# EasyEDA Pro project EasyEDA_ELRS-Transmitter.epro

# Schematic Schematic2
Board Name: PCB2; Create Date: 2026-03-08; Page Name: P1; Project Name: elrsTransmitter; Schematic Name: Schematic2; Update Date: 2026-03-08; Company: EasyEDA.com; Page Size: A4; Version: V1.0
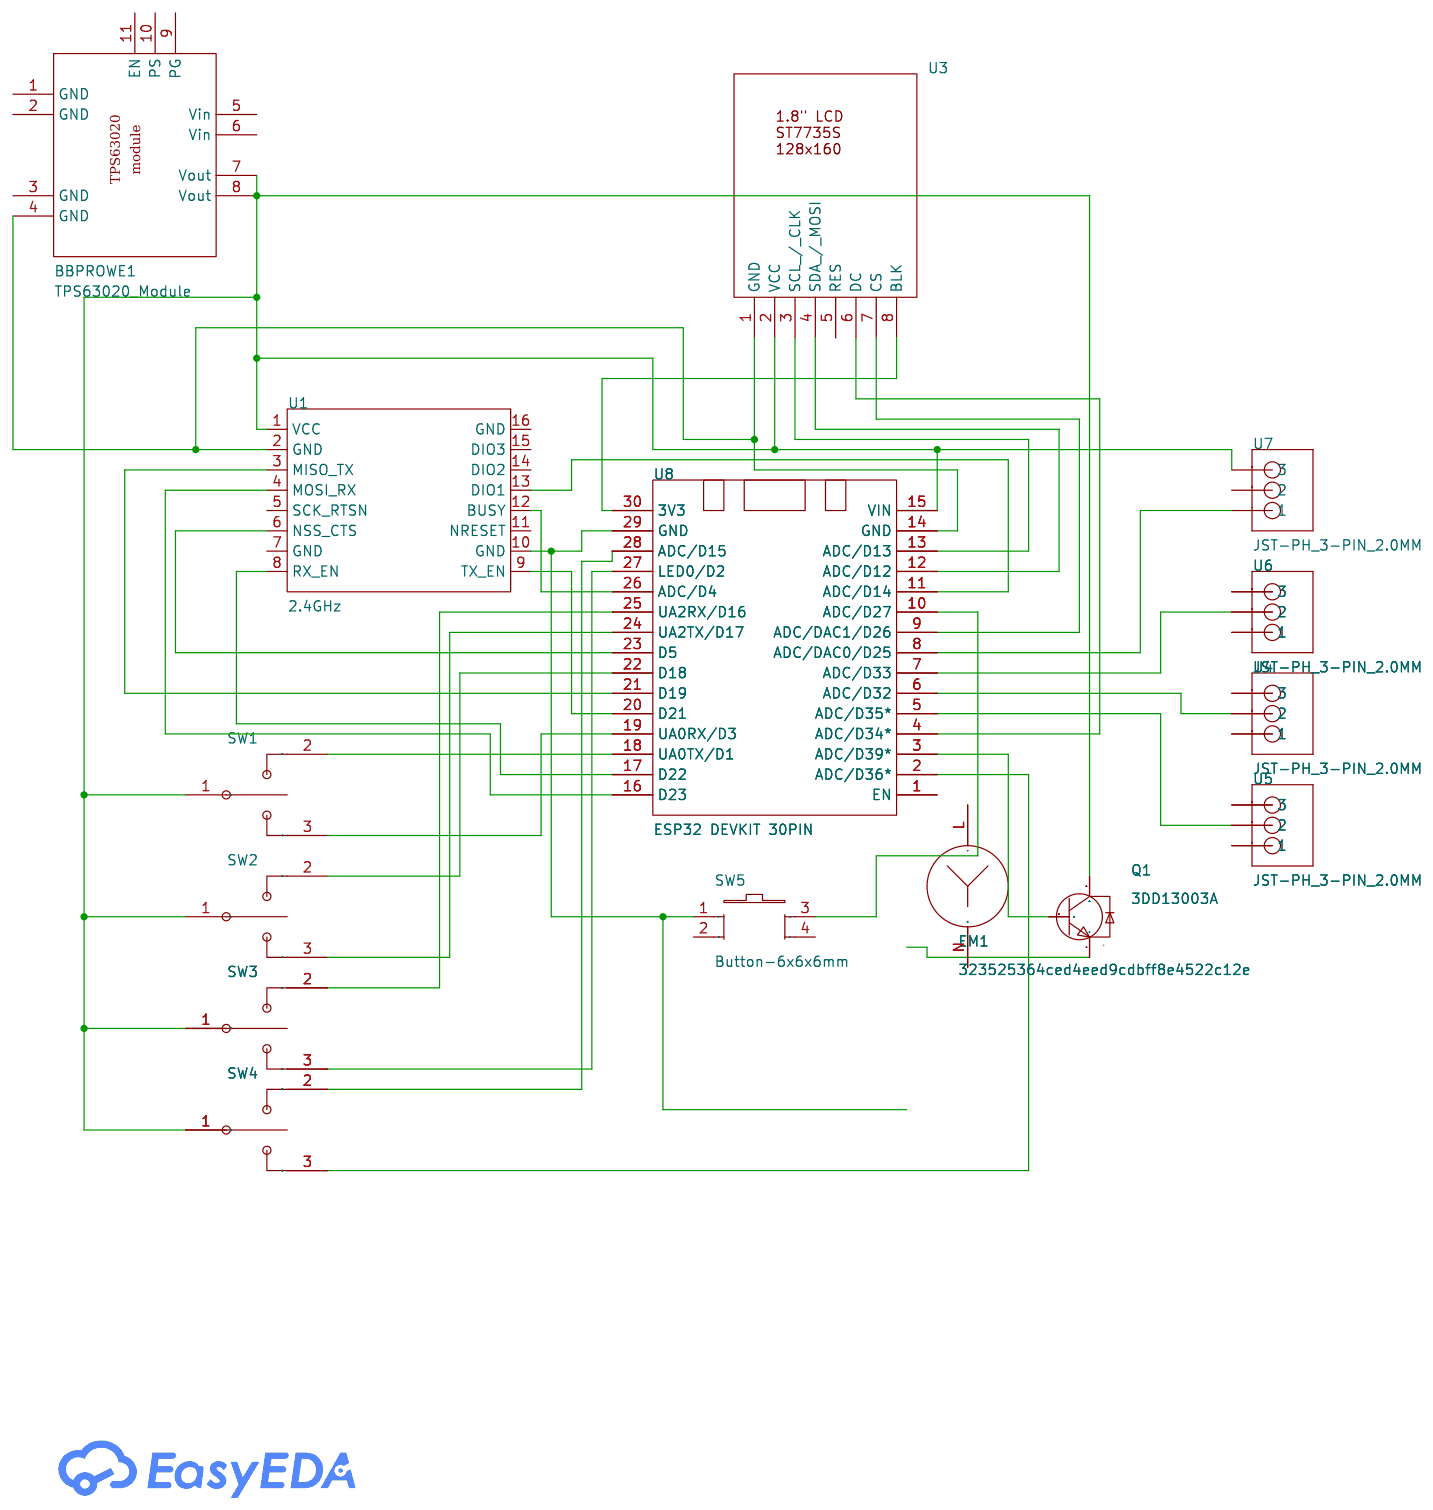
[diagram p0: schematic sheet]

## Parts
BBPROWE1  TPS63020_Module  [TPS63020_MODULE_PCB]
EM1  323525364ced4eed9cdbff8e4522c12e  [CONN-TH_2P-P2.54-V]
Q1  3DD13003A  [TO-92-3_L4.8-W3.7-P1.27-L]
SW1  -  [3_Pin_Toggle_Switch_Footprint]
SW2  -  [3_Pin_Toggle_Switch_Footprint]
SW3  -  [3_Pin_Toggle_Switch_Footprint]
SW4  -  [3_Pin_Toggle_Switch_Footprint]
SW5  Button-6x6x6mm  [SW-TH_4PIN-L6.00-W6.00]
U1  2.4GHz  [WIRELM-SMD_E28-2G4M27SX]
U3  -  [WeAct 1.8 inch TFT ST7735S]
U4  JST-PH_3-PIN_2.0MM  [JST PH 3-PIN 2.0MM TOP ENTRY]
U5  JST-PH_3-PIN_2.0MM  [JST PH 3-PIN 2.0MM TOP ENTRY]
U6  JST-PH_3-PIN_2.0MM  [JST PH 3-PIN 2.0MM TOP ENTRY]
U7  JST-PH_3-PIN_2.0MM  [JST PH 3-PIN 2.0MM TOP ENTRY]
U8  ESP32 DEVKIT 30PIN  [ESP32 DEVKIT 30P]

## Library data of the parts
BBPROWE1 = TPS63020_Module
EM1 = GVI AC Fan: GVI AC Fan for half size server rack; Manufacturer: GVI
Q1 = 3DD13003A: Current - Collector(Ic):1.5A Collector - Emitter Voltage VCEO:450V Pd - Power Dissipation:40W Transition frequency(fT):4MHz Current - Collector Cutoff:100uA Vce Saturation(VCE(sat)):2V@1.5A,0.5A; LCSC Part Name: MOSFET管; Supplier Part: C5148290; Manufacturer: 吉林华微; Supplier Footprint: TO-92-FJ; JLCPCB Part Class: Extended Part; Datasheet: https://item.szlcsc.com/datasheet/3DD13003A/5771105.html; Supplier: LCSC; Current - Collector(Ic): 1.5A; Collector - Emitter Voltage VCEO: 450V; Pd - Power Dissipation: 40W; Transition frequency(fT): 4MHz; Current - Collector Cutoff: 100uA; Vce Saturation(VCE(sat)): 2V@1.5A,0.5A
SW1-SW4 = 3_Position_Toggle_Switch
SW5 = Button-6x6x6mm: Supplier Part: C71836; Supplier: LCSC; Manufacturer: BBJ; Manufacturer Part: Switch,6*6*6Plastic head,260G, 0.25mm,Straight line
U1 = E28-2G4M27SX: Frequency:2.4GHz; LCSC Part Name: 2.4G LORA扩频 SX1280spi模组 测距定位RSSI; Supplier Part: C5333988; Manufacturer: EBYTE(亿佰特); Supplier Footprint: SMD,20x16mm; JLCPCB Part Class: Extended Part; Datasheet: https://item.szlcsc.com/datasheet/E28-2G4M27SX/6097540.html; Supplier: LCSC
U3 = WeAct 1.8inch TFT Display ST7735
U4-U7 = JST-PH_3-PIN_2.0MM
U8 = ESP32 DEVKIT 30PIN

## Nets
$1N1359: BBPROWE1.4(GND) U1.2(GND) U3.1(GND) U8.14(GND)
$1N1452: BBPROWE1.7(Vout) BBPROWE1.8(Vout) Q1.2(C) SW1.1 SW2.1 SW3.1 SW4.1 U1.1(VCC) U3.2(VCC) U7.3 U8.15(VIN)
$1N1514: U1.3(MISO_TX) U8.21(D19)
$1N1520: U1.4(MOSI_RX) U8.16(D23)
$1N1532: U1.6(NSS_CTS) U8.23(D5)
$1N1538: U1.9(TX_EN) U8.20(D21)
$1N1545: U1.8(RX_EN) U8.17(D22)
$1N1554: U1.13(DIO1) U8.11(ADC/D14)
$1N1582: U1.12(BUSY) U8.26(ADC/D4)
$1N1700: SW1.2 U8.18(UA0TX/D1)
$1N1708: SW1.3 U8.19(UA0RX/D3)
$1N1714: SW2.2 U8.22(D18)
$1N1721: SW2.3 U8.24(UA2TX/D17)
$1N1728: SW3.2 U8.25(UA2RX/D16)
$1N1735: SW3.3 U8.27(LED0/D2)
$1N1742: SW4.2 U8.28(ADC/D15)
$1N1753: SW4.3 U8.2(ADC/D36*)
$1N1760: Q1.3(B) U8.3(ADC/D39*)
$1N1766: U3.3(SCL / CLK) U8.13(ADC/D13)
$1N1773: U3.4(SDA / MOSI) U8.12(ADC/D12)
$1N1780: U3.7(CS) U8.9(ADC/DAC1/D26)
$1N1788: U3.6(DC) U8.4(ADC/D34*)
$1N1827: U3.8(BLK) U8.30(3V3)
$1N1835: U7.1 U8.8(ADC/DAC0/D25)
$1N1841: U6.2 U8.7(ADC/D33)
$1N1848: U4.2 U8.6(ADC/D32)
$1N1855: U5.2 U8.5(ADC/D35*)
$1N2129: SW5.3 U8.10(ADC/D27)
Net-(SW5-1): SW5.1 U1.10(GND) U8.29(GND)

Not connected (* = marked no-connect by the designer): BBPROWE1 1(GND) 2(GND) 3(GND) 5(Vin) 6(Vin) 9(PG) 10(PS) 11(EN); EM1 L N; Q1 1(E); SW5 2 4; U1 5(SCK_RTSN) 7(GND) 11(NRESET) 14(DIO2) 15(DIO3) 16(GND); U3 5(RES); U4 1 3; U5 1 3; U6 1 3; U7 2; U8 1(EN)

# Board PCB2
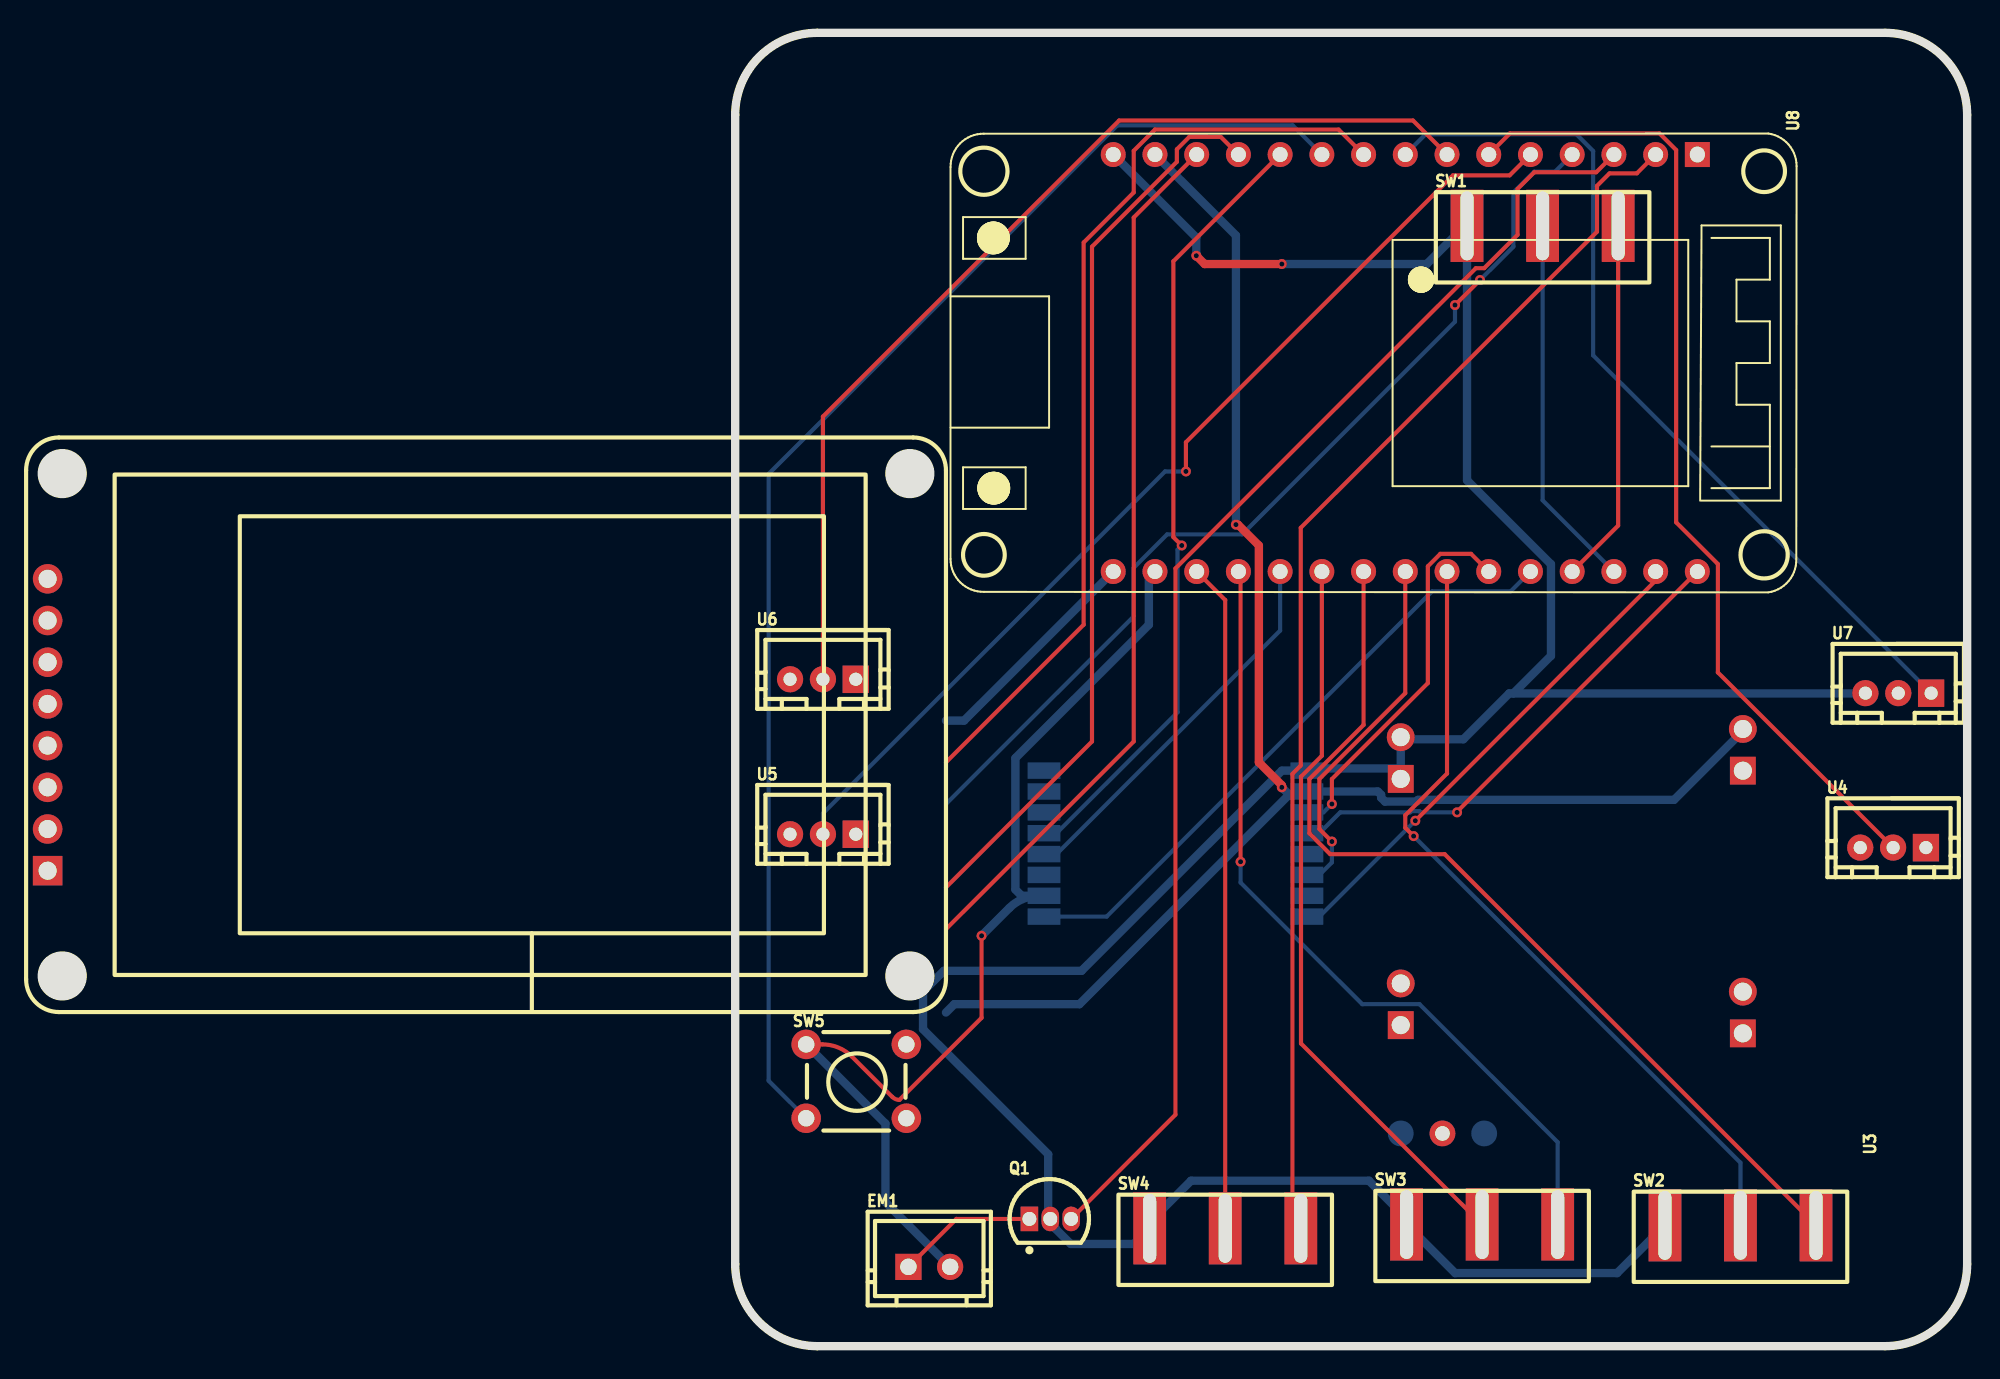
[diagram p1: board, top side]
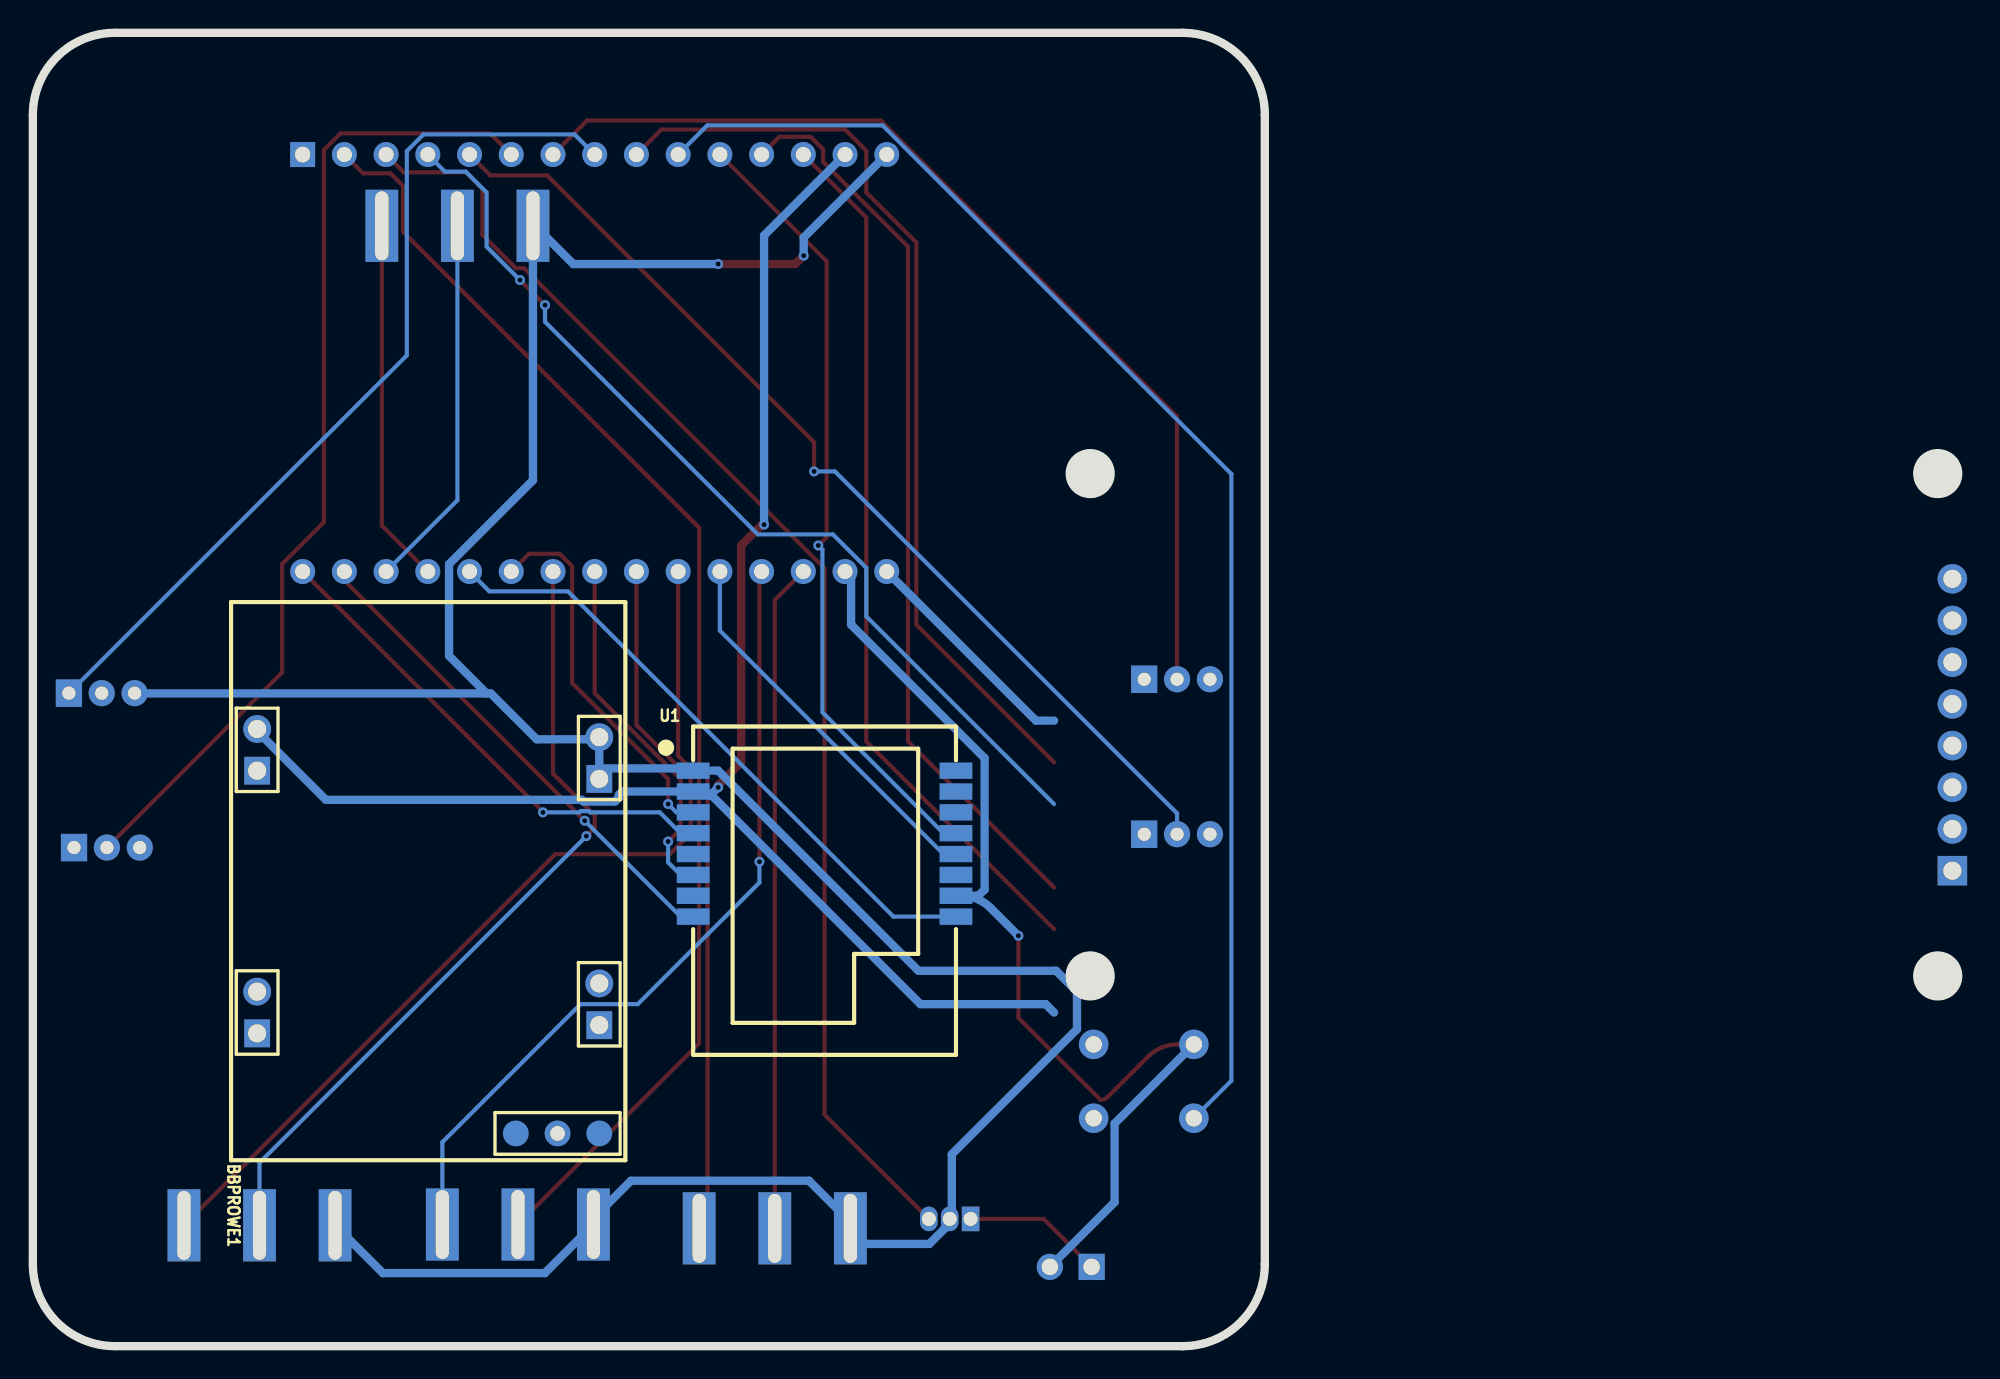
[diagram p2: board, bottom side, seen from below]

Outline 117.46 x 80 mm; copper layers: Top Layer, Bottom Layer. Coordinates in mm from the lower left corner of the outline.
Outline path: 42.46,75 arc(43.93,78.54) 47.46,80 112.46,80 arc(116,78.53) 117.46,75 117.46,5 arc(116,1.46) 112.46,0 47.46,0 arc(43.93,1.46) 42.46,5 42.46,75
Stack: Top Layer 0.035mm / Dielectric1 1.51mm FR4 er 4.5 / Bottom Layer 0.035mm

## Design rules (mm)
template: JLCPCB Capability(Two Layers Board)
spacing copperThickness1oz (default): track to track 0.102, other pairs 0.152 to 0.3
spacing copperThickness2oz: track to track 0.203, other pairs 0.152 to 0.3
track width copperThickness1oz (default): min 0.127, default 0.254, max 2.54
track width copperThickness2oz: min 0.203, default 0.254, max 2.54
differential pair differentialPair (default): width min 0.127, default 0.254, max 2.54; gap min 0.152, default 0.152
via viaSize (default): diameter min 0.5, default 0.61, max 10; hole min 0.3, default 0.305, max 6.3

## Placement (name value [footprint] x y rotation side)
BBPROWE1  TPS63020_Module  [TPS63020_MODULE_PCB]  93.4 28.33 90 bottom
EM1  323525364ced4eed9cdbff8e4522c12e  [CONN-TH_2P-P2.54-V]  54.28 4.83 0 top
Q1  3DD13003A  [TO-92-3_L4.8-W3.7-P1.27-L]  61.65 7.75 0 top
SW1  -  [3_Pin_Toggle_Switch_Footprint]  91.62 66.04 0 top
SW2  -  [3_Pin_Toggle_Switch_Footprint]  103.66 5.16 0 top
SW3  -  [3_Pin_Toggle_Switch_Footprint]  87.93 5.21 0 top
SW4  -  [3_Pin_Toggle_Switch_Footprint]  72.3 4.98 0 top
SW5  Button-6x6x6mm  [SW-TH_4PIN-L6.00-W6.00]  49.83 16.13 0 top
U1  2.4GHz  [WIRELM-SMD_E28-2G4M27SX]  69.27 30.61 180 bottom
U3  -  [WeAct 1.8 inch TFT ST7735S]  55.3 20.32 90 top
U4  JST-PH_3-PIN_2.0MM  [JST PH 3-PIN 2.0MM TOP ENTRY]  108.96 28.57 0 top
U5  JST-PH_3-PIN_2.0MM  [JST PH 3-PIN 2.0MM TOP ENTRY]  43.8 29.39 0 top
U6  JST-PH_3-PIN_2.0MM  [JST PH 3-PIN 2.0MM TOP ENTRY]  43.8 38.82 0 top
U7  JST-PH_3-PIN_2.0MM  [JST PH 3-PIN 2.0MM TOP ENTRY]  109.27 37.98 0 top
U8  ESP32 DEVKIT 30PIN  [ESP32 DEVKIT 30P]  105.08 71.89 270 top

## Footprints (pads in the part's own frame, mm; a bottom-side part is the same pattern mirrored in y, then rotated)
3_Pin_Toggle_Switch_Footprint
  rect 2x4.4 hole 0.8x4.2: 1(-4.6,2.2) 2(0,2.2) 3(4.6,2.2)
CONN-TH_2P-P2.54-V
  rect 1.6x1.6 hole 1: L(-1.27,0)
  round 1.6 hole 1: N(1.27,0)
ESP32 DEVKIT 30P
  rect 1.524x1.524 hole 0.96x0.914: 1(-0.7,-4.04)
  round 1.524 hole 0.914: 2(-0.7,-6.58) 3(-0.7,-9.12) 4(-0.7,-11.661) 5(-0.7,-14.2) 6(-0.7,-16.741) 7(-0.7,-19.28) 8(-0.7,-21.82) 9(-0.7,-24.36) 10(-0.7,-26.901) 11(-0.7,-29.441) 12(-0.7,-31.98) 13(-0.7,-34.52) 14(-0.7,-37.06) 15(-0.7,-39.6) 16(24.7,-4.04) 17(24.7,-6.58) 18(24.7,-9.12) 19(24.7,-11.661) 20(24.7,-14.2) 21(24.7,-16.741) 22(24.7,-19.28) 23(24.7,-21.82) 24(24.7,-24.36) 25(24.7,-26.901) 26(24.7,-29.441) 27(24.7,-31.98) 28(24.7,-34.52) 29(24.7,-37.06) 30(24.7,-39.6)
JST PH 3-PIN 2.0MM TOP ENTRY
  rect 1.6x1.677 hole 0.8: 1(6,1.8)
  round 1.6 hole 0.8: 2(4,1.801) 3(1.999,1.801)
SW-TH_4PIN-L6.00-W6.00
  round 1.8 hole 1: 1(-3.05,2.25) 2(3.05,2.25) 3(-3.05,-2.25) 4(3.05,-2.25)
TO-92-3_L4.8-W3.7-P1.27-L
  rect 1.07x1.5 hole 0.85: 1(-1.27,0)
  oval 1.07x1.5 hole 0.85: 2(0,0) 3(1.27,0)
TPS63020_MODULE_PCB
  rect 1.7x1.575 hole 1.1: 1(-9.27,10.414) 3(6.73,10.414) 5(-8.77,-10.414) 7(6.23,-10.414)
  round 1.7 hole 1.1: 2(-6.73,10.414) 4(9.27,10.414) 6(-6.23,-10.414) 8(8.77,-10.414)
  round 1.575 smd: 9(-15.367,-10.414) 11(-15.367,-5.334)
  round 1.575 hole 0.889: 10(-15.367,-7.874)
WeAct 1.8 inch TFT ST7735S
  rect 1.8x1.8 hole 1.1: 1(8.638,54.689)
  round 1.8 hole 1.1: 2(11.178,54.689) 3(13.718,54.689) 4(16.258,54.689) 5(18.798,54.689) 6(21.338,54.689) 7(23.878,54.689) 8(26.418,54.689)
WIRELM-SMD_E28-2G4M27SX
  rect 2x1 smd: 1(-8,4.445) 2(-8,3.175) 3(-8,1.905) 4(-8,0.635) 5(-8,-0.635) 6(-8,-1.905) 7(-8,-3.175) 8(-8,-4.445) 9(8,-4.445) 10(8,-3.175) 11(8,-1.905) 12(8,-0.635) 13(8,0.635) 14(8,1.905) 15(8,3.175) 16(8,4.445)

## Nets
As in the schematic, except:
$1N1588: EM1.N SW5.1 U1.10 U8.29
$1N2226: EM1.L Q1.1

Pads without a net: BBPROWE1 1 2 3 5 6 9 10 11; SW5 2 4; U1 5 7 11 14 15 16; U3 5; U4 1 3; U5 1 3; U6 1 3; U7 2; U8 1

## Via types
v1: diameter 0.61, hole 0.305, Top Layer to Bottom Layer, 15 vias

## Routing (per net, layer and track width the routed paths; a pad name or vN(x,y) marks a point on that pad's centre or on a via; arc(x,y) is an arc through that point)
$1N1359: length 98.8
  Top Layer w0.508: v1(75.74,34.04) 75.74,34.17 74.34,35.56 74.34,48.77 73.07,50.04 v1(72.95,50.04)
  Bottom Layer w0.254: 76.25,33.53 77.01,33.53 U1.2
  Bottom Layer w0.508: 55.3,20.32 55.8,20.83 63.42,20.83 76.12,33.53 76.25,33.53 v1(75.74,34.04) ; v1(72.95,50.04) 72.95,67.66 U8.14 ; U1.2 81.59,33.79 81.79,33.58 81.79,33.41 82.03,33.17 83.94,33.17 84.04,33.28 99.62,33.28 103.81,37.47
$1N1452: length 185.2
  Top Layer w0.508: v1(70.54,66.42) 71.04,65.92 v1(75.74,65.92)
  Bottom Layer w0.254: 82.98,34.43 82.98,35.19
  Bottom Layer w0.508: 89.84,39.76 92.13,42.05 92.13,47.64 87.02,52.74 87.02,68.37 84.56,65.92 v1(75.74,65.92) ; 89.84,39.76 89.59,39.76 86.79,36.97 82.98,36.97 82.98,35.19 77.4,35.19 U1.1 75.74,35.06 63.55,22.86 55.17,22.86 53.9,21.59 53.9,19.31 61.52,11.69 61.52,7.88 Q1.2 61.65,7.5 61.97,7.17 61.97,7.15 62.89,6.23 66.74,6.23 SW4.1 67.7,7.56 70.21,10.08 81.05,10.08 83.33,7.79 SW3.1 86.3,4.45 96.15,4.45 SW2.1 ; 89.84,39.76 111.25,39.76 U7.3 ; U8.15 70.54,67.53 v1(70.54,66.42)
$1N1514: length 23.1
  Top Layer w0.254: U8.21 87.26,48.26 85.39,48.26 84.63,47.5 84.63,40.39 78.79,34.55 v1(78.79,33.02)
  Bottom Layer w0.254: U1.3 78.28,32.52 v1(78.79,33.02)
$1N1520: length 30.5
  Top Layer w0.254: v1(86.41,32.52) 86.41,32.56 U8.16
  Bottom Layer w0.254: U1.4 78.03,31.25 79.3,32.52 83.55,32.52 83.63,32.59 84.11,32.59 84.19,32.52 v1(86.41,32.52)
$1N1532: length 22
  Top Layer w0.254: v1(78.79,30.74) 78.03,31.5 78.03,34.55 83.26,39.78 U8.23
  Bottom Layer w0.254: v1(78.79,30.74) 78.79,29.47 78.03,28.71 U1.6
$1N1538: length 38.3
  Bottom Layer w0.254: U8.20 89.67,45.98 84.89,45.98 65.08,26.17 U1.9
$1N1545: length 30.3
  Top Layer w0.254: v1(83.87,32.01) 98.5,46.64 U8.17
  Bottom Layer w0.254: U1.8 78.03,26.17 v1(83.87,32.01)
$1N1554: length 48.2
  Top Layer w0.254: U8.11 69.14,66.09 69.14,49.28 v1(69.65,48.77)
  Bottom Layer w0.254: U1.13 62.03,31.25 69.39,38.61 69.39,48.52 v1(69.65,48.77)
$1N1582: length 23.6
  Bottom Layer w0.254: U1.12 62.03,29.98 75.64,43.59 U8.26
$1N1588: length 65.4
  Top Layer w0.254: v1(57.46,25) 57.46,20 52.46,15 arc(52.23,15.05) 52.03,15.18 49.57,17.64 arc(48.75,18.19) 47.77,18.38 SW5.1
  Bottom Layer w0.508: EM1.N 51.61,8.77 51.61,13.56 SW5.1 ; 60.95,27.44 U1.10 ; 60.95,27.44 59.9,27.44 59.52,27.82 59.52,35.82 67.65,43.95 67.65,46.81 U8.29 ; 60.95,27.44 arc(59.98,27.24) 59.16,26.69 v1(57.46,25)
$1N1700: length 23
  Bottom Layer w0.254: U8.18 91.62,51.53 91.62,68.37
$1N1708: length 22.3
  Top Layer w0.254: U8.19 96.22,49.98 96.22,68.37
$1N1714: length 49.3
  Top Layer w0.254: U8.22 85.8,34.88 83.26,32.34 83.26,31.58 v1(83.77,31.07)
  Bottom Layer w0.254: SW2.2 103.66,11.17 v1(83.77,31.07)
$1N1721: length 58.1
  Top Layer w0.254: SW2.3 85.66,29.97 78.69,29.97 77.42,31.24 77.42,34.54 80.72,37.84 U8.24
$1N1728: length 44.9
  Top Layer w0.254: SW3.2 76.91,18.44 76.91,34.69 78.18,35.96 U8.25
$1N1735: length 49.9
  Top Layer w0.254: U8.27 73.23,47.05 v1(73.23,29.51)
  Bottom Layer w0.254: v1(73.23,29.51) 73.23,28.24 80.64,20.83 84.12,20.83 92.53,12.42 SW3.3
$1N1742: length 40.7
  Top Layer w0.254: SW4.2 72.3,45.45 U8.28
$1N1753: length 75.8
  Top Layer w0.254: SW4.3 76.39,7.69 76.39,34.86 76.9,35.37 76.9,49.85 94.93,67.88 94.93,70.68 95.69,71.44 97.35,71.44 U8.2
$1N1760: length 81
  Top Layer w0.254: U8.3 94.88,71.5 91.11,71.5 90.09,70.49 90.09,67.69 88.06,65.66 87.55,65.66 69.27,47.38 69.27,14.1 Q1.3
$1N1766: length 53.5
  Top Layer w0.254: U8.13 66.73,68.75 66.73,36.83 55.3,25.4
$1N1773: length 55.3
  Top Layer w0.254: 55.3,27.94 64.19,36.83 64.19,66.97 69.35,72.14 69.35,72.9 70.11,73.66 72.02,73.66 U8.12
$1N1780: length 57.1
  Top Layer w0.254: 55.3,35.56 63.68,43.95 63.68,67.23 66.73,70.28 66.73,72.82 68.02,74.11 79.19,74.11 U8.9
$1N1788: length 58.8
  Top Layer w0.254: v1(86.28,63.42) v1(87.81,64.94)
  Bottom Layer w0.254: U8.4 92.38,71.55 91.11,71.55 89.84,70.28 89.84,66.97 v1(87.81,64.94) ; v1(86.28,63.42) 86.28,62.4 73.33,49.45 68.76,49.45 66.73,47.42 66.73,44.45 55.3,33.02
$1N1827: length 13.9
  Bottom Layer w0.508: U8.30 56.4,38.1 55.3,38.1
$1N1835: length 53.9
  Bottom Layer w0.254: U7.1 94.7,60.35 94.7,72.8 93.68,73.81 84.49,73.81 U8.8
$1N1841: length 62.3
  Top Layer w0.254: U6.2 47.81,56.63 65.84,74.66 83.72,74.66 U8.7
$1N1848: length 60.3
  Top Layer w0.254: U8.6 89.63,73.88 98.73,73.88 99.75,72.86 99.75,50.18 102.29,47.64 102.29,41.04 112.96,30.37
$1N1855: length 62
  Top Layer w0.254: U8.5 89.61,71.32 86.16,71.32 69.9,55.06 v1(69.9,53.28)
  Bottom Layer w0.254: U5.2 47.81,32.46 68.63,53.28 v1(69.9,53.28)
$1N2129: length 83.4
  Bottom Layer w0.254: U8.10 76.4,74.36 65.73,74.36 44.5,53.13 44.5,16.17 SW5.3
$1N2226: length 8.6
  Top Layer w0.254: EM1.L 55.93,7.75 Q1.1
